# Altium schematic sheet 一体板1.SchDoc
size A3
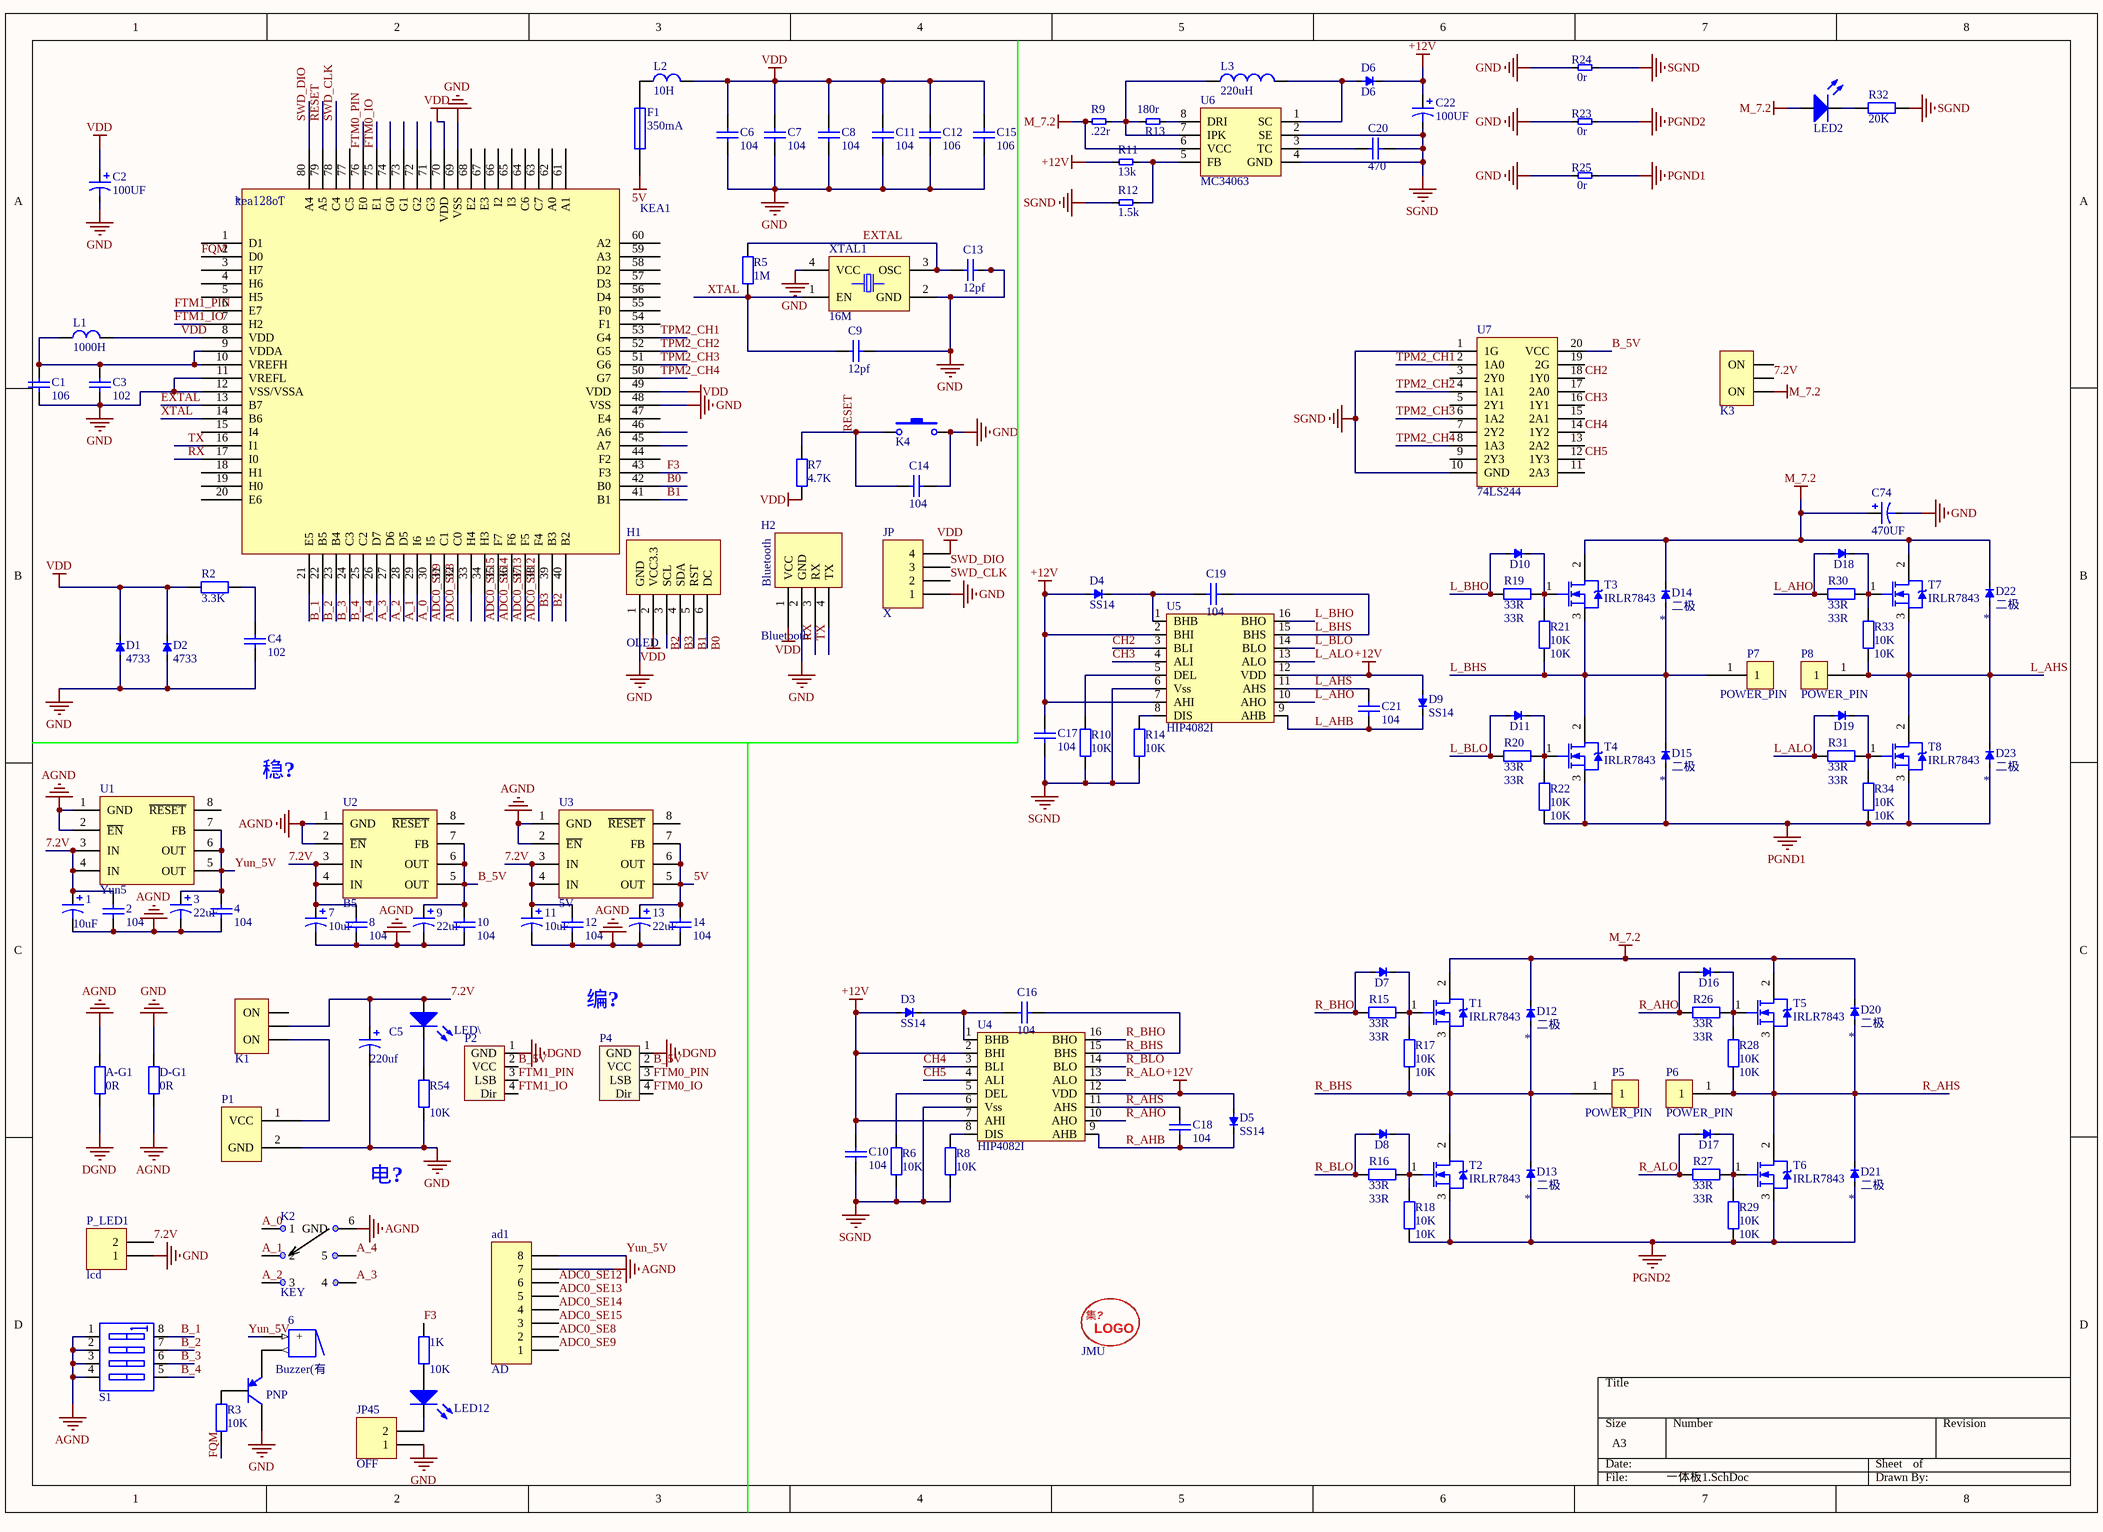
[diagram p0: 一体板1.SchDoc]

## Parts
1  10uF  [pol cap(10uF)]
1K  value 10K  [0805]  (hidden comment: 1K)
2  104  [0805]
3  22uF  [pol cap(10uF)]
4  104  [0805]
5  PNP  [PNP]
6  10U1  [Buzzer]  (value not drawn)
7  10uF  [pol cap(10uF)]
8  104  [0805]
9  22uF  [pol cap(10uF)]
10  104  [0805]
11  10uF  [pol cap(10uF)]
12  104  [0805]
13  22uF  [pol cap(10uF)]
14  104  [0805]
A-G1  0R  [0805]
ad1  AD  [HDR1X8]
C1  106  [0603]
C2  100UF  [pol cap(10uF)]
C3  102  [0805]
C4  102  [0805]
C5  value 220uf  [ED6.3]  (hidden comment: 220u)
C6  104  [0603]
C7  104  [0603]
C8  104  [0603]
C9  12pf  [0805-0C]
C10  104  [0603]
C11  104  [0603]
C12  106  [0603]
C13  12pf  [0805-0C]
C14  104  [0603]
C15  106  [0603]
C16  104  [0603]
C17  104  [0603]
C18  104  [0603]
C19  104  [0603]
C20  470  [0805]
C21  104  [0603]
C22  100UF  [ED8]
C74  470UF  [ED8]
D1  4733  [二极管]
D2  4733  [二极管]
D3  SS14  [二极管]
D4  SS14  [二极管]
D5  SS14  [二极管]
D6  D6  [二极管]
D7  T5  [LED(0805)]  (value not drawn)
D8  T7  [LED(0805)]  (value not drawn)
D9  SS14  [二极管]
D10  T1  [LED(0805)]  (value not drawn)
D11  T3  [LED(0805)]  (value not drawn)
D12  *  [二极管]
D13  *  [二极管]
D14  *  [二极管]
D15  *  [二极管]
D16  T6  [LED(0805)]  (value not drawn)
D17  T8  [LED(0805)]  (value not drawn)
D18  T2  [LED(0805)]  (value not drawn)
D19  T4  [LED(0805)]  (value not drawn)
D20  *  [二极管]
D21  *  [二极管]
D22  *  [二极管]
D23  *  [二极管]
D-G1  0R  [0805]
F1  350mA  [0805]
H1  OLED  [S0P6]
H2  Bluetooth  [S0P4]
JMU  JMU  [JMU_logo（2）]  (value not drawn)
JP  X  [HDR1X4]
JP45  OFF  [HDR1X2]
K1  KEY  [钮子开关（大）]  (value not drawn)
K2  KEY  [五向按键（大）]
K3  KEY  [钮子开关（大）]  (value not drawn)
K4  Key  [K_Press]  (value not drawn)
KEA1  *  [LQFP80]
L1  1000H  [1206C]
L2  10H  [1206C]
L3  220uH  [电感（220uh）]
LED2  LED  [LED(0805)]  (value not drawn)
LED12  LED  [LED(0805)]  (value not drawn)
LED\  LED  [LED(0805)]  (value not drawn)
P1  P0_1  [接线端子]  (value not drawn)
P2  B1  [编码器1]  (value not drawn)
P4  B2  [编码器1]  (value not drawn)
P5  POWER_PIN  [POWER_PIN]
P6  POWER_PIN  [POWER_PIN]
P7  POWER_PIN  [POWER_PIN]
P8  POWER_PIN  [POWER_PIN]
P_LED1  lcd  [HDR1X2]
R2  3.3K  [0805]
R3  10K  [0805]
R5  1M  [0603-r]
R6  10K  [0603]
R7  4.7K  [0603-r]
R8  10K  [0603]
R9  .22r  [0805]
R10  10K  [0603]
R11  13k  [0805]
R12  1.5k  [0805]
R13  180r  [AXIAL0.3]
R14  10K  [0603]
R15  33R  [0603]
R16  33R  [0603]
R17  10K  [0603]
R18  10K  [0603]
R19  33R  [0603]
R20  33R  [0603]
R21  10K  [0603]
R22  10K  [0603]
R23  0r  [0805]
R24  0r  [0805]
R25  0r  [0805]
R26  33R  [0603]
R27  33R  [0603]
R28  10K  [0603]
R29  10K  [0603]
R30  33R  [0603]
R31  33R  [0603]
R32  20K  [0603]
R33  10K  [0603]
R34  10K  [0603]
R54  10K  [0805]
S1  S1  [拨码开关*4]  (value not drawn)
T1  IRLR7843  [IRLR7843(MOS)]
T2  IRLR7843  [IRLR7843(MOS)]
T3  IRLR7843  [IRLR7843(MOS)]
T4  IRLR7843  [IRLR7843(MOS)]
T5  IRLR7843  [IRLR7843(MOS)]
T6  IRLR7843  [IRLR7843(MOS)]
T7  IRLR7843  [IRLR7843(MOS)]
T8  IRLR7843  [IRLR7843(MOS)]
U1  Yun5  [SOIC-8]
U2  B5  [SOIC-8]
U3  5V  [SOIC-8]
U4  HIP4082I  [HIP4082I]
U5  HIP4082I  [HIP4082I]
U6  MC34063  [MA34063]
U7  74LS244  [74LS244D]
XTAL1  16M  [XTAL-3225]

## Nets
5V: 13.1 14.1 F1.2 U3.5(OUT) U3.6(OUT) U3.7(FB)
+12V: C10.2 C17.2 C22.1 D3.1(+) D4.1(+) D5.1(+) D6.2(-) D9.1(+) R11.1 U4.2(BHI) U4.7(AHI) U4.12(VDD) U5.2(BHI) U5.7(AHI) U5.12(VDD)
AGND: 1.2 2.2 3.2 4.2 7.2 8.2 9.2 10.2 11.2 12.2 13.2 14.2 A-G1.2 ad1.7 D-G1.1 K2.6(GND) S1.1(A1) S1.2(A2) S1.3(A3) S1.4(A4) U1.1(GND) U1.2(~{EN}) U2.1(GND) U2.2(~{EN}) U3.1(GND) U3.2(~{EN})
DGND: A-G1.1 P2.1(GND) P4.1(GND)
GND: 5.1(C) C1.1 C2.2 C3.1 C4.1 C5.2 C6.1 C7.1 C8.1 C9.2 C11.1 C12.1 C13.2 C14.1 C15.1 C74.2 D1.1(+) D2.1(+) D-G1.2 H1.1(GND) H2.2(GND) JP.1 JP45.1 K4.2 KEA1.11(VREFL) KEA1.12(VSS/VSSA) KEA1.48(VSS) KEA1.69(VSS) P1.2(GND) P_LED1.1 R23.1 R24.1 R25.1 R54.1 XTAL1.2(GND) XTAL1.4(VCC)
M_7.2: C74.1 D12.2(-) D14.2(-) D20.2(-) D22.2(-) K3.1(ON) LED2.1(A) R9.1 T1.2(D) T3.2(D) T5.2(D) T7.2(D) U6.6(VCC)
PGND1: D15.1(+) D23.1(+) R22.1 R25.2 R34.1 T4.3(S) T8.3(S)
PGND2: D13.1(+) D21.1(+) R18.1 R23.2 R29.1 T2.3(S) T6.3(S)
SGND: C10.1 C17.1 C20.2 C22.2 R6.1 R8.1 R10.1 R12.1 R14.1 R24.2 R32.2 U4.6(Vss) U5.6(Vss) U6.2(SE) U6.4(GND) U7.1(1G) U7.10(GND)
VDD: C2.1 C6.2 C7.2 C8.2 C11.2 C12.2 C15.2 D1.2(-) D2.2(-) H1.2(VCC3.3) H2.1(VCC) JP.4 KEA1.8(VDD) KEA1.49(VDD) KEA1.70(VDD) L1.2 L2.2 R2.1 R7.2
7.2V: 1.1 2.1 7.1 8.1 11.1 12.1 C5.1 K1.2(com) K3.2(com) LED\.1(A) P_LED1.2 U1.3(IN) U1.4(IN) U2.3(IN) U2.4(IN) U3.3(IN) U3.4(IN)
A_0: K2.1 KEA1.30(I5)
A_1: K2.2 KEA1.29(I6)
A_2: K2.3 KEA1.28(D5)
A_3: K2.4 KEA1.27(D6)
A_4: K2.5 KEA1.26(D7)
ADC0_SE8: ad1.2 KEA1.32(C0)
ADC0_SE9: ad1.1 KEA1.31(C1)
ADC0_SE12: ad1.6 KEA1.38(F4)
ADC0_SE13: ad1.5 KEA1.37(F5)
ADC0_SE14: ad1.4 KEA1.36(F6)
ADC0_SE15: ad1.3 KEA1.35(F7)
B0: H1.6(DC) KEA1.42(B0)
B1: H1.5(RST) KEA1.41(B1)
B2: H1.3(SCL) KEA1.40(B2)
B3: H1.4(SDA) KEA1.39(B3)
B_1: KEA1.22(B5) S1.8(B1)
B_2: KEA1.23(B4) S1.7(B2)
B_3: KEA1.24(C3) S1.6(B3)
B_4: KEA1.25(C2) S1.5(B4)
B_5V: 9.1 10.1 P2.2(VCC) P4.2(VCC) U2.5(OUT) U2.6(OUT) U2.7(FB) U7.20(VCC)
CH2: U5.3(BLI) U7.18(1Y0)
CH3: U5.4(ALI) U7.16(1Y1)
CH4: U4.3(BLI) U7.14(1Y2)
CH5: U4.4(ALI) U7.12(1Y3)
EXTAL: C13.1 KEA1.13(B7) R5.2 XTAL1.3(OSC)
F3: 1K.2 KEA1.43(F3)
FQM: KEA1.2(D0) R3.1
FTM0_IO: KEA1.75(E1) P4.4(Dir)
FTM0_PIN: KEA1.76(E0) P4.3(LSB)
FTM1_IO: KEA1.7(H2) P2.4(Dir)
FTM1_PIN: KEA1.6(E7) P2.3(LSB)
L_AHB: C21.2 D9.2(-) U5.9(AHB)
L_AHO: D18.1(+) R30.2 U5.10(AHO)
L_AHS: C21.1 D22.1(+) D23.2(-) P8.1 R33.1 T7.3(S) T8.2(D) U5.11(AHS)
L_ALO: D19.1(+) R31.2 U5.13(ALO)
L_BHO: D10.1(+) R19.2 U5.16(BHO)
L_BHS: C19.1 D14.1(+) D15.2(-) P7.1 R21.1 T3.3(S) T4.2(D) U5.15(BHS)
L_BLO: D11.1(+) R20.2 U5.14(BLO)
R_AHB: C18.1 D5.2(-) U4.9(AHB)
R_AHO: D16.1(+) R26.2 U4.10(AHO)
R_AHS: C18.2 D20.1(+) D21.2(-) P6.1 R28.1 T5.3(S) T6.2(D) U4.11(AHS)
R_ALO: D17.1(+) R27.2 U4.13(ALO)
R_BHO: D7.1(+) R15.2 U4.16(BHO)
R_BHS: C16.2 D12.1(+) D13.2(-) P5.1 R17.1 T1.3(S) T2.2(D) U4.15(BHS)
R_BLO: D8.1(+) R16.2 U4.14(BLO)
RESET: C14.2 K4.1 KEA1.79(A5) R7.1
RX: H2.3(RX) KEA1.17(I0)
SWD_CLK: JP.2 KEA1.78(C4)
SWD_DIO: JP.3 KEA1.80(A4)
TPM2_CH1: KEA1.53(G4) U7.2(1A0)
TPM2_CH2: KEA1.52(G5) U7.4(1A1)
TPM2_CH3: KEA1.51(G6) U7.6(1A2)
TPM2_CH4: KEA1.50(G7) U7.8(1A3)
TX: H2.4(TX) KEA1.16(I1)
XTAL: C9.1 KEA1.14(B6) R5.1 XTAL1.1(EN)
Yun_5V: 3.1 4.1 6.1(+) ad1.8 U1.5(OUT) U1.6(OUT) U1.7(FB)
Net1K_1: 1K.1 LED12.1(A)
Net5_2: 5.2(B) R3.2
Net5_3: 5.3(E) 6.2
NetC1_2: C1.2 C3.2 KEA1.9(VDDA) KEA1.10(VREFH) L1.1
NetC4_2: C4.2 R2.2
NetC16_1: C16.1 D3.2(-) U4.1(BHB)
NetC19_2: C19.2 D4.2(-) U5.1(BHB)
NetC20_1: C20.1 U6.3(TC)
NetD6_1: D6.1(+) L3.2 U6.1(SC)
NetD7_2: D7.2(-) R15.1 R17.2 T1.1(G)
NetD8_2: D8.2(-) R16.1 R18.2 T2.1(G)
NetD10_2: D10.2(-) R19.1 R21.2 T3.1(G)
NetD11_2: D11.2(-) R20.1 R22.2 T4.1(G)
NetD16_2: D16.2(-) R26.1 R28.2 T5.1(G)
NetD17_2: D17.2(-) R27.1 R29.2 T6.1(G)
NetD18_2: D18.2(-) R30.1 R33.2 T7.1(G)
NetD19_2: D19.2(-) R31.1 R34.2 T8.1(G)
NetF1_1: F1.1 L2.1
NetJP45_2: JP45.2 LED12.2(K)
NetK1_1: K1.1(ON) P1.1(VCC)
NetL3_1: L3.1 R9.2 R13.1 U6.7(IPK)
NetLED2_2: LED2.2(K) R32.1
NetLE~{D}_2: LED\.2(K) R54.2
NetR6_2: R6.2 U4.5(DEL)
NetR8_2: R8.2 U4.8(DIS)
NetR10_2: R10.2 U5.5(DEL)
NetR11_2: R11.2 R12.2 U6.5(FB)
NetR13_2: R13.2 U6.8(DRI)
NetR14_2: R14.2 U5.8(DIS)

Not connected (* = marked no-connect by the designer): K1 3(ON); K3 3(ON); KEA1 1(D1) 3(H7) 4(H6) 5(H5) 15(I4) 18(H1) 19(H0) 20(E6) 21(E5) 33(H4) 34(H3) 44(F2) 45(A7) 46(A6) 47(E4) 54(F1) 55(F0) 56(D4) 57(D3) 58(D2) 59(A3) 60(A2) 61(A1) 62(A0) 63(C7) 64(C6) 65(I3) 66(I2) 67(E3) 68(E2) 71(G3) 72(G2) 73(G1) 74(G0) 77(C5); U1 8(~{RESET}); U2 8(~{RESET}); U3 8(~{RESET}); U7 3(2Y0) 5(2Y1) 7(2Y2) 9(2Y3) 11(2A3) 13(2A2) 15(2A1) 17(2A0) 19(2G)

## Notes on the sheet
- 稳?
- 编?
- 电?
- (in symbol Buzzer(有源蜂鸣器)) Buzzer(有
- (in symbol JMU-LOGO) 集?; LOGO
- (in symbol 二极管) 二极

## Library data of the parts
1 3 7 9 11 13 = pol cap: 通用有极电容
  1 7 11: value: 10uF
  3 9 13: value: 22uF
1K R54 = Res2: Resistor; Published: 8-Jun-2000; LatestRevisionDate: 17-Jul-2002; LatestRevisionNote: Re-released for DXP Platform.; PackageReference: AXIAL-0.4; Publisher: Altium Limited; PackageDescription: Axial Device, Thru-Hole; 2 Leads; 0.4 in Pin Spacing
  R54: Value: 10K
2 4 8 10 12 14 = Cap: Capacitor; Published: 8-Jun-2000; LatestRevisionDate: 17-Jul-2002; LatestRevisionNote: Re-released for DXP Platform.; PackageReference: RAD-0.3; Publisher: Altium Limited; PackageDescription: Radial Cap, Thru-Hole; 2 Leads; 0.3 in Pin Spacing; Value: 104
6 = Buzzer(有源蜂鸣器)
A-G1 D-G1 = Res: 通用电阻; Value: 0
ad1 = Header 8: Header, 8-Pin; Revision: 17-Jul-2002: Re-released for DXP Platform.; Publisher: Altium Limited
C1 C3 C4 C6-C8 C10-C12 C14-C21 = Cap: 无极电容; Value: 10uF
C2 = pol cap: 通用有极电容; value: 22uF
C5 = Cap Pol3: Polarized Capacitor (Surface Mount); Published: 8-Jun-2000; LatestRevisionDate: 29-May-2009; LatestRevisionNote: IPC-7351 Footprint Added.; PackageReference: C0805; Publisher: Altium Limited; PackageDescription: Chip Capacitor
C9 C13 = CAP
C22 C74 = 固态贴片电容: ED8:470UF  ED6.3:100UF
D1 D2 D6 = IN5819
D3-D5 D9 D12-D15 D20-D23 = 二极管
D7 D8 D10 D11 D16-D19 = IN
F1 = Fuse
JMU = JMU-LOGO
JP = Header 4: Header, 4-Pin; Revision: 17-Jul-2002: Re-released for DXP Platform.; Publisher: Altium Limited
JP45 P_LED1 = Header 2: Header, 2-Pin; Publisher: Altium Limited
  JP45: Revision: 17-Jul-2002: Re-released for DXP Platform.
  P_LED1: LatestRevisionDate: 17-Jul-2002; LatestRevisionNote: Re-released for DXP Platform.
K1 K3 = 钮子开关（大）: AC 250V/6A
K2 = 五轴按键（大）
K4 = K_Press: 贴片按键
KEA1 = ke
L1 L2 = Inductor
L3 = 电感 220uh: 7*7*4; Value: 220uH
LED2 LED12 LED\ = LED: 发光二极管
P1 = dianchi
P2 P4 = 编码器
R2 R32 = Res: 通用电阻; Value: 10K
R3 R6 R8 R10 R14-R22 R26-R31 R33 R34 = Res: 通用电阻
  R3 R6 R8 R10 R14 R17 R18 R21 R22 R28 R29 R33 R34: Value: 10K
  R15 R16 R19 R20 R26 R27 R30 R31: Value: 33R
R5 R7 = RES
R9 R11-R13 R23-R25 = R
S1 = 拨码开关(4位): 拨码开关（4位）
T1-T8 = N_MOS(IRLR7843)
U1-U3 = TPS7350: 稳压元件（5V）
XTAL1 = XTAL